# Altium schematic sheet LEDs.SchDoc: LED
size 279 x 215 mm; CheckedBy: KYLE HONG; Engineer: SAHIL KALE; Revision: 1.0; SheetNumber: 3; SheetTotal: 4
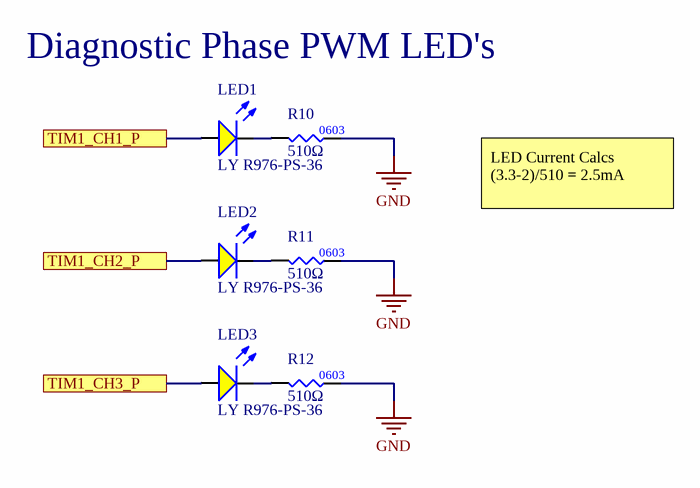
[diagram p0: LEDs.SchDoc]

## Parts
LED1  Manufacturer Part Number 1: LY R976-PS-36  [LED_0805_YELLOW]  (hidden comment: LED_YELLOW)
LED2  Manufacturer Part Number 1: LY R976-PS-36  [LED_0805_YELLOW]  (hidden comment: LED_YELLOW)
LED3  Manufacturer Part Number 1: LY R976-PS-36  [LED_0805_YELLOW]  (hidden comment: LED_YELLOW)
R10  value 510Ω  [RES0603]  (hidden comment: RES_510Ω_0603_5%)
R11  value 510Ω  [RES0603]  (hidden comment: RES_510Ω_0603_5%)
R12  value 510Ω  [RES0603]  (hidden comment: RES_510Ω_0603_5%)

## Ports
TIM1_CH1_P, TIM1_CH2_P, TIM1_CH3_P

## Nets
GND: R10.2 R11.2 R12.2
TIM1_CH1_P: LED1.1(A) ; port TIM1_CH1_P
TIM1_CH2_P: LED2.1(A) ; port TIM1_CH2_P
TIM1_CH3_P: LED3.1(A) ; port TIM1_CH3_P
NetLED1_2: LED1.2(K) R10.1
NetLED2_2: LED2.2(K) R11.1
NetLED3_2: LED3.2(K) R12.1

## Notes on the sheet
- Diagnostic Phase PWM LED's
- LED Current Calcs
  (3.3-2)/510 = 2.5mA
- University of Waterloo Robotics Team
- 200 University Ave W
- REV
- PROJECT
- Waterloo, Ontario, Canada
- N2L 3G1
- DOCUMENT
- ENGINEER
- REVIEWER
- MODIFIED
- SHEET
- OF
- (in symbol RES_510Ω_0603_5%) 0603

## Library data of the parts
LED1-LED3 = LED_YELLOW: LED YELLOW DIFFUSED 0805 SMD; Manufacturer 1: OSRAM; Forward Voltage Drop: 2.2V; Package: 0805 (2012 Metric); Supplier Part Number 1: 475-2560-1-ND; Supplier 1: Digi-Key
R10-R12 = RES_510Ω_0603_5%: RES 510 OHM 5% 1/10W 0603; Manufacturer 1: Vishay Dale; Manufacturer Part Number 1: CRCW0603510RJNEA; Supplier Part Number 1: 541-510GCT-ND; Supplier 1: Digi-Key